# EasyEDA Pro project MN42_v2.eprj, board MOAR_Board
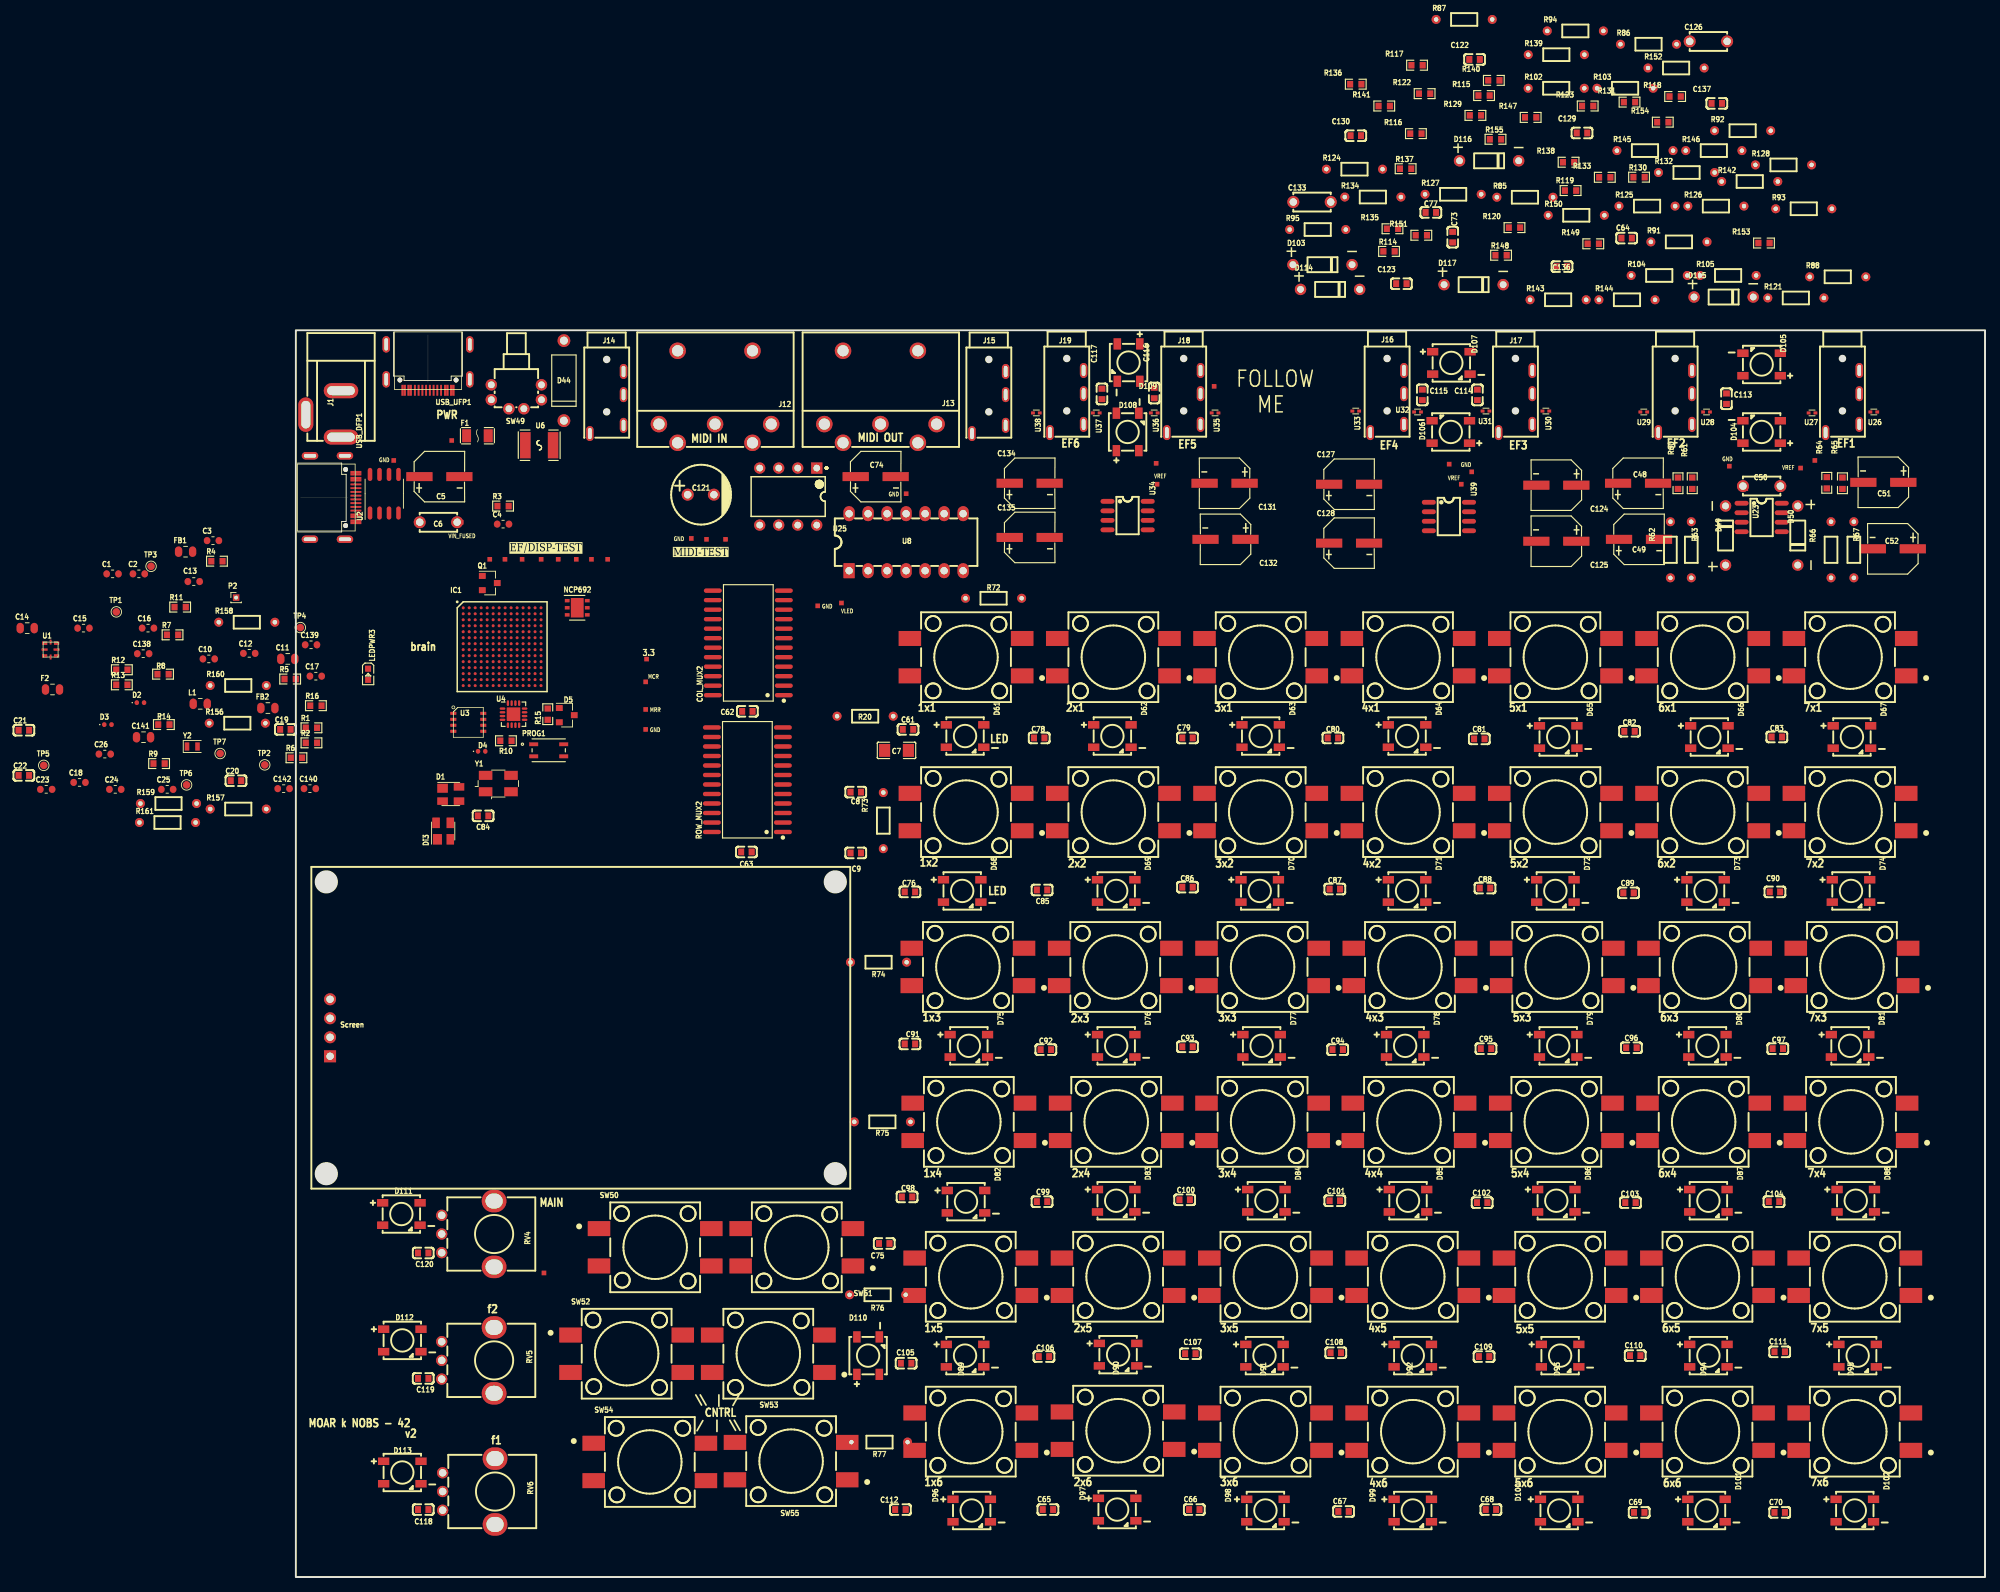
[diagram p4: board, top side]
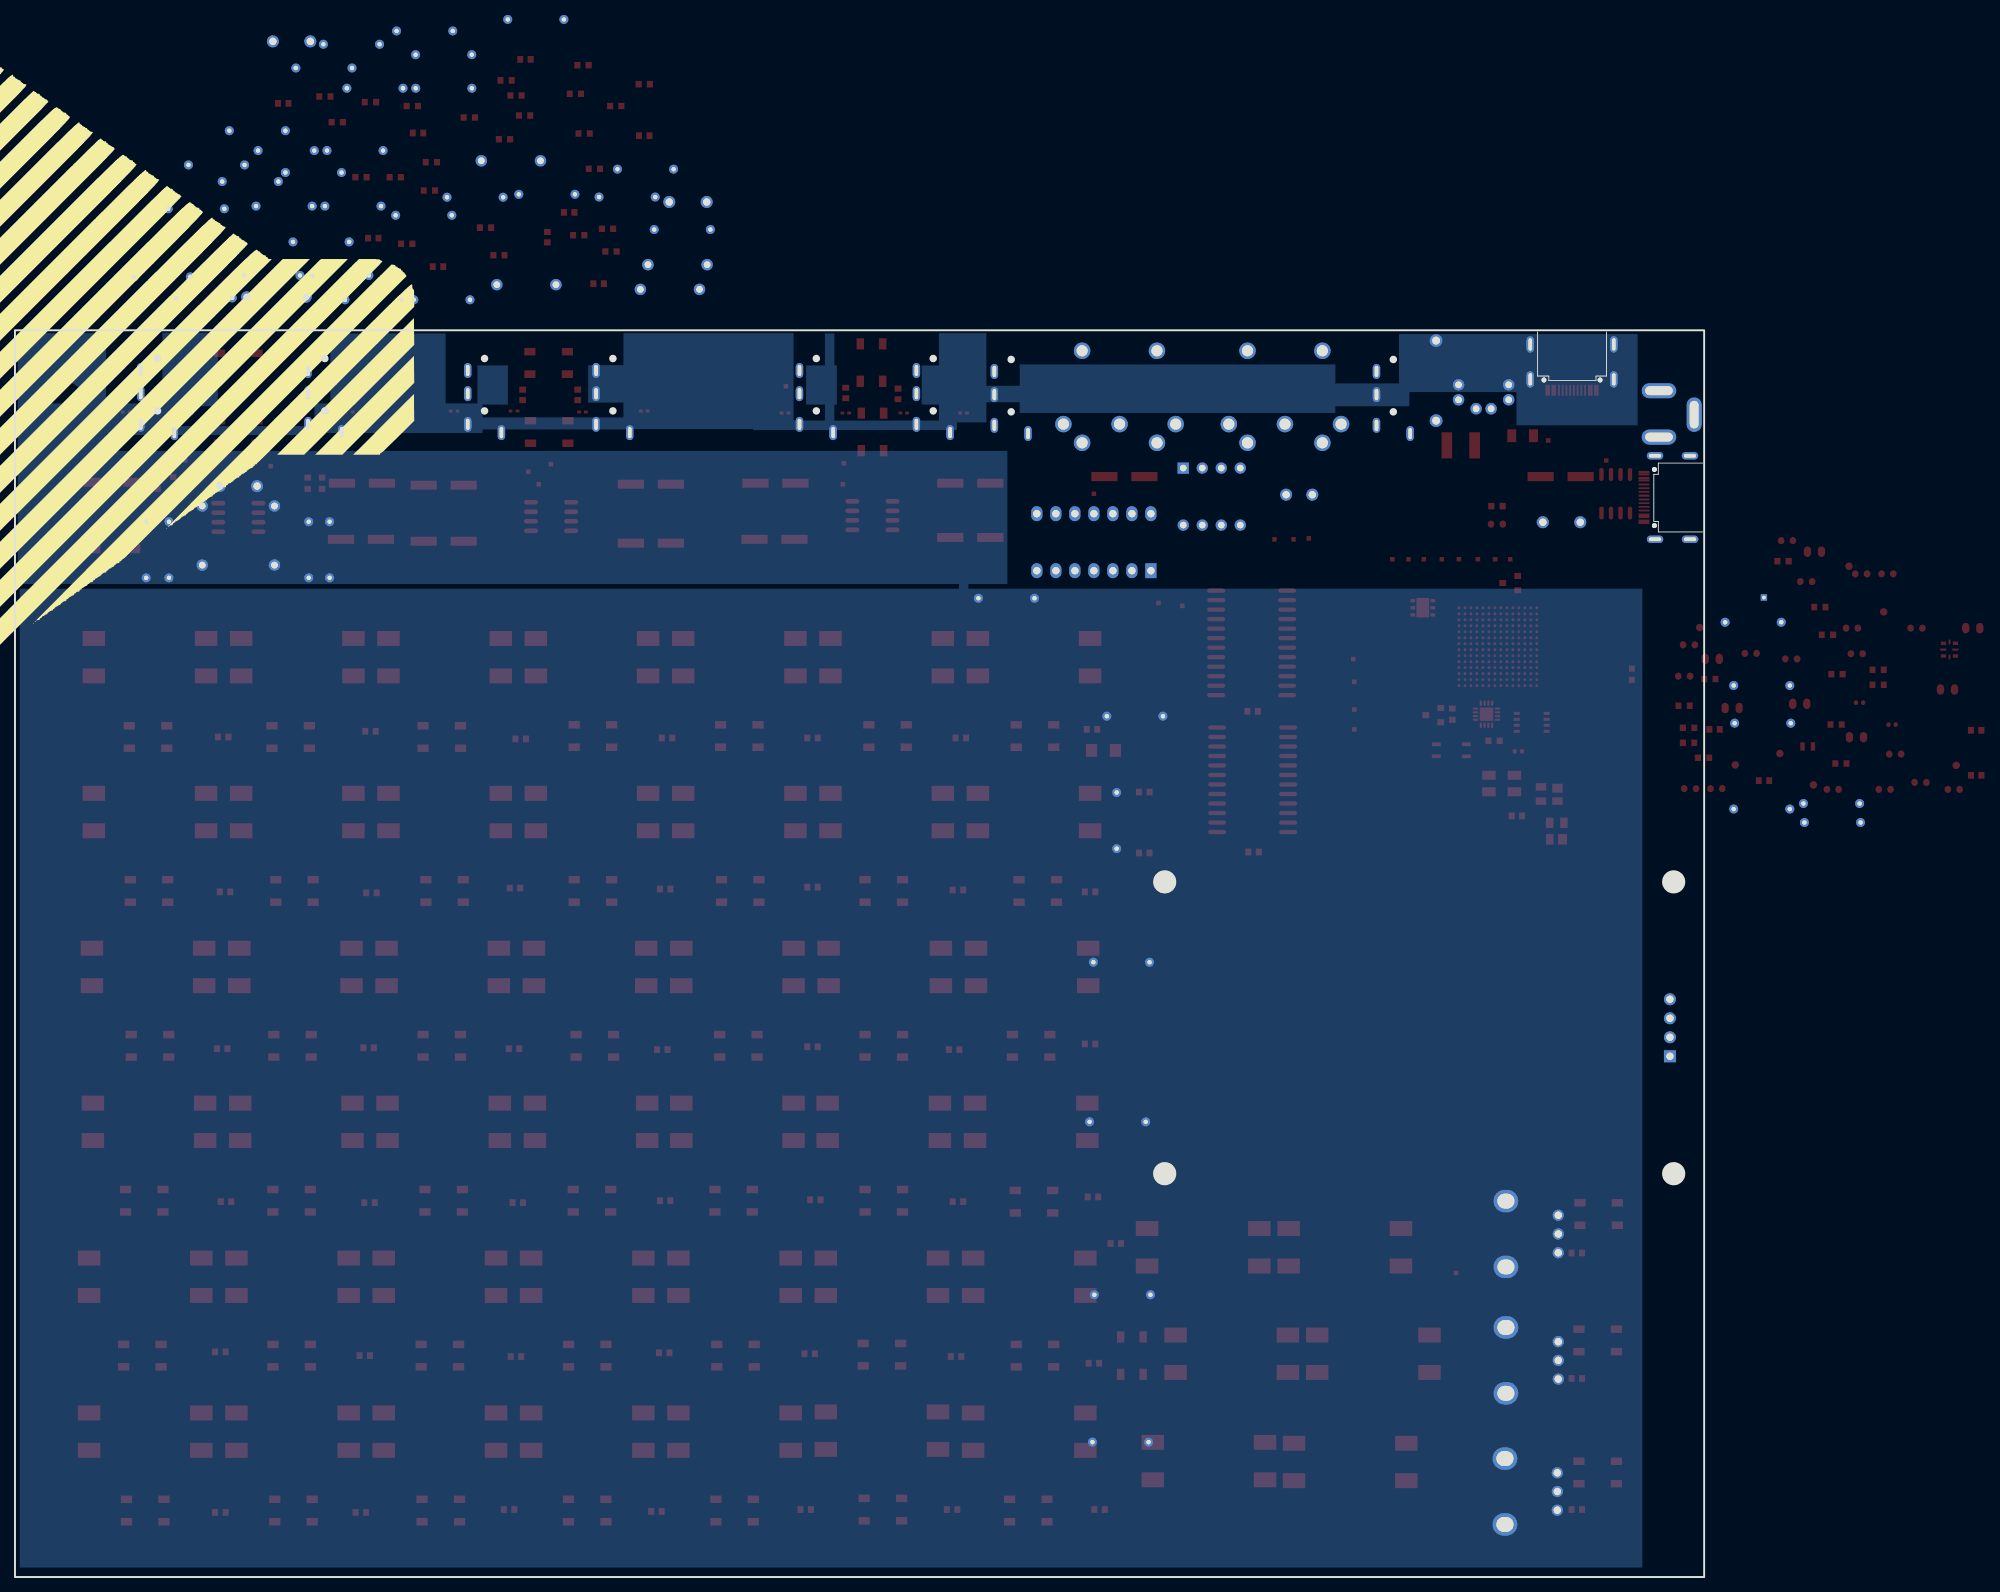
[diagram p5: board, bottom side, seen from below]

Outline 225.68 x 166.62 mm; copper layers: Top Layer, Inner1, Inner2, Bottom Layer. Coordinates in mm from the lower left corner of the outline.
Outline path: rectangle 0,166.62 225.68,0
Stack: Top Layer 0.035mm Outer layer thickness 1oz / Dielectric1 0.2104mm 7628 RC49% 8.6mil / Inner1 0.0152mm Inner layer thickness / Dielectric2 1.065mm 1.1mm H/HOZ Copper / Inner2 0.0152mm Inner layer thickness / Dielectric3 0.2104mm 7628 RC49% 8.6mil / Bottom Layer 0.035mm Outer layer thickness 1oz

## Design rules (mm)
template: User Custom Config
spacing safeClearance (default): track to track 0.152, other pairs 0.152 to 0.3
track width trackWidth (default): min 0.152, default 0.254, max 2.54
differential pair differentialPair (default): width min 0.127, default 0.254, max 2.54; gap min 0.152, default 0.152
via viaSize (default): diameter min 0.61, default 0.711, max 10; hole min 0.3, default 0.305, max 5.999

## Placement (name value [footprint] x y rotation side)
C1  0.22uf  [Capacitor_SMD:C_0603_1608Metric]  -24.49 134.07 0 top
C2  0.22uf  [Capacitor_SMD:C_0603_1608Metric]  -20.98 134.07 0 top
C3  2.2uf  [Capacitor_SMD:C_0603_1608Metric]  -11.07 138.51 0 top
C4  0.22uf  [Capacitor_SMD:C_0603_1608Metric]  27.69 140.72 0 top
C5  220uF  [CAP-SMD_BD6.3-L6.6-W6.6-FD]  19.18 147.07 0 top
C6  100nF  [CAP-TH_L5.0-W2.5-P5.00-D1.0]  19.05 140.97 0 top
C7  100uF  [C1206]  80.25 110.48 0 top
C8  1uF  [C0603]  74.8 104.9 180 top
C9  100nF  [C0603]  74.8 96.77 180 top
C10  0.22uf  [Capacitor_SMD:C_0603_1608Metric]  -11.63 122.7 0 top
C11  10uf  [Capacitor_SMD:C_0805_2012Metric]  -1.08 122.7 0 top
C12  4.7uf  [Capacitor_SMD:C_0603_1608Metric]  -6.22 123.44 0 top
C13  0.22uf  [Capacitor_SMD:C_0603_1608Metric]  -13.64 133.04 0 top
C14  10uf  [Capacitor_SMD:C_0805_2012Metric]  -35.89 126.82 0 top
C15  4.7uf  [Capacitor_SMD:C_0603_1608Metric]  -28.37 126.82 0 top
C16  10nf  [Capacitor_SMD:C_0603_1608Metric]  -19.75 126.82 0 top
C17  0.22uf  [Capacitor_SMD:C_0603_1608Metric]  2.67 120.4 0 top
C18  0.22uf  [Capacitor_SMD:C_0603_1608Metric]  -28.9 106.2 0 top
C19  10pf  [C0603]  -1.4 113.28 0 top
C20  10pf  [C0603]  -8 106.43 0 top
C21  9pf  [C0603]  -36.34 113.17 0 top
C22  9pf  [C0603]  -36.34 107.13 0 top
C23  0.22uf  [Capacitor_SMD:C_0603_1608Metric]  -33.35 105.27 0 top
C24  4.7uf  [Capacitor_SMD:C_0603_1608Metric]  -24.12 105.27 0 top
C25  0.22uf  [Capacitor_SMD:C_0603_1608Metric]  -17.18 105.27 0 top
C26  4.7uf  [Capacitor_SMD:C_0603_1608Metric]  -25.53 109.98 0 top
C48  1uF  [CAP-SMD_BD6.3-L6.6-W6.6-FD]  179.32 146.18 0 top
C49  1uF  [CAP-SMD_BD6.3-L6.6-W6.6-FD]  179.45 138.68 0 top
C50  100nF  [CAP-TH_L5.0-W2.5-P5.00-D1.0]  195.83 145.8 180 top
C51  1uF  [CAP-SMD_BD6.3-L6.6-W6.6-FD]  212.09 146.3 180 top
C52  1uF  [CAP-SMD_BD6.3-L6.6-W6.6-FD]  213.36 137.41 180 top
C61  100nF  [C0603]  81.79 113.28 0 top
C62  100nF  [C0603]  60.33 115.7 0 top
C63  100nF  [C0603]  60.2 96.9 0 top
C64  100nF  [C0603]  177.8 178.94 0 top
C65  100nF  [C0603]  100.48 9.02 0 top
C66  100nF  [C0603]  120.04 9.02 0 top
C67  100nF  [C0603]  139.98 8.76 0 top
C68  100nF  [C0603]  159.66 9.02 0 top
C69  100nF  [C0603]  179.47 8.64 0 top
C70  100nF  [C0603]  198.25 8.64 0 top
C73  1uF  [C0603]  154.56 179.07 270 top
C74  10uF  [CAP-SMD_BD6.3-L6.6-W6.6-FD]  77.47 147.07 0 top
C75  100nF  [C0603]  78.61 44.58 0 top
C76  100nF  [C0603]  82.04 91.57 0 top
C77  4.7nF  [C0603]  151.64 182.37 0 top
C78  100nF  [C0603]  99.31 112.14 0 top
C79  100nF  [C0603]  119.13 112.14 0 top
C80  100nF  [C0603]  138.56 112.14 180 top
C81  100nF  [C0603]  158.12 112.01 180 top
C82  100nF  [C0603]  178.18 113.03 180 top
C83  100nF  [C0603]  197.87 112.27 180 top
C84  100nF  [C0603]  25.02 101.73 0 top
C85  100nF  [C0603]  99.7 91.82 0 top
C86  100nF  [C0603]  119.13 92.2 0 top
C87  100nF  [C0603]  138.81 91.95 0 top
C88  100nF  [C0603]  158.88 92.08 0 top
C89  100nF  [C0603]  178.05 91.44 0 top
C90  100nF  [C0603]  197.61 91.57 0 top
C91  100nF  [C0603]  82.04 71.25 0 top
C92  100nF  [C0603]  100.2 70.48 0 top
C93  100nF  [C0603]  119.13 70.87 0 top
C94  100nF  [C0603]  139.19 70.48 0 top
C95  100nF  [C0603]  159 70.61 0 top
C96  100nF  [C0603]  178.44 70.74 0 top
C97  100nF  [C0603]  197.99 70.61 0 top
C98  100nF  [C0603]  81.66 50.8 0 top
C99  100nF  [C0603]  99.7 50.16 0 top
C100  100nF  [C0603]  118.74 50.42 0 top
C101  100nF  [C0603]  138.81 50.29 0 top
C102  100nF  [C0603]  158.5 50.04 0 top
C103  100nF  [C0603]  178.31 50.04 0 top
C104  100nF  [C0603]  197.49 50.16 0 top
C105  100nF  [C0603]  81.53 28.57 0 top
C106  100nF  [C0603]  99.95 29.46 0 top
C107  100nF  [C0603]  119.51 29.84 0 top
C108  100nF  [C0603]  138.94 29.97 0 top
C109  100nF  [C0603]  158.75 29.46 0 top
C110  100nF  [C0603]  178.94 29.59 0 top
C111  100nF  [C0603]  198.25 30.1 0 top
C112  100nF  [C0603]  80.77 9.02 0 top
C113  100nF  [C0603]  191.13 157.48 270 top
C114  100nF  [C0603]  157.86 157.99 270 top
C115  100nF  [C0603]  150.5 157.99 270 top
C116  100nF  [C0603]  114.68 158.24 270 top
C117  100nF  [C0603]  107.7 158.12 270 top
C118  100nF  [C0603]  17.02 9.02 0 top
C119  100nF  [C0603]  17.02 26.54 0 top
C120  100nF  [C0603]  17.02 43.31 0 top
C121  1000uF  [CAP-TH_BD8.0-P3.50-D0.6-FD]  54.1 144.65 0 top
C122  2.2uF  [C0603]  157.48 202.82 0 top
C123  2.2uF  [C0603]  147.7 172.85 0 top
C124  1uF  [CAP-SMD_BD6.3-L6.6-W6.6-FD]  168.4 145.92 180 top
C125  1uF  [CAP-SMD_BD6.3-L6.6-W6.6-FD]  168.4 138.43 180 top
C126  100nF  [CAP-TH_L5.0-W2.5-P5.00-D1.0]  188.72 205.23 0 top
C127  1uF  [CAP-SMD_BD6.3-L6.6-W6.6-FD]  140.72 146.05 0 top
C128  1uF  [CAP-SMD_BD6.3-L6.6-W6.6-FD]  140.72 138.18 0 top
C129  2.2uF  [C0603]  171.83 193 0 top
C130  2.2uF  [C0603]  141.61 192.63 0 top
C131  1uF  [CAP-SMD_BD6.3-L6.6-W6.6-FD]  124.08 146.18 180 top
C132  1uF  [CAP-SMD_BD6.3-L6.6-W6.6-FD]  124.21 138.68 180 top
C133  100nF  [CAP-TH_L5.0-W2.5-P5.00-D1.0]  135.76 183.77 0 top
C134  1uF  [CAP-SMD_BD6.3-L6.6-W6.6-FD]  98.04 146.18 0 top
C135  1uF  [CAP-SMD_BD6.3-L6.6-W6.6-FD]  98.04 138.94 0 top
C136  2.2uF  [C0603]  169.16 175.13 0 top
C137  2.2uF  [C0603]  189.84 196.94 0 top
C138  2.2uf  [Capacitor_SMD:C_0603_1608Metric]  -20.39 123.4 0 top
C139  0.22uf  [Capacitor_SMD:C_0603_1608Metric]  2.03 124.59 0 top
C140  4.7uf  [Capacitor_SMD:C_0603_1608Metric]  1.88 105.37 0 top
C141  10uf  [Capacitor_SMD:C_0805_2012Metric]  -20.35 112.24 0 top
C142  10nf  [Capacitor_SMD:C_0603_1608Metric]  -1.63 105.37 0 top
COL_MUX2  CD74HC4067M96  [SOIC-24_L15.4-W7.5-P1.27-LS10.3-BL]  60.45 124.84 90 top
D1  SP0503BAHT  [Package_TO_SOT_SMD:SOT-143]  20.7 104.65 0 top
D2  LED  [LED_SMD:LED_0402_1005Metric]  -20.77 116.86 0 top
D3  LED  [LED_SMD:LED_0402_1005Metric]  -25.11 113.93 0 top
D4  LED  [LED_SMD:LED_0402_1005Metric]  24.82 110.35 0 top
D5  BAT54C  [Package_TO_SOT_SMD:SOT-23]  36.19 115.19 0 top
D44  SA6.0A  [DO-15_BD3.1-L6.7-P10.70-D0.8-RD]  35.81 159.89 90 top
D49  1N4148PF  [DO-35_BD1.9-L3.9-P7.90-D0.5-FD]  191.01 139.19 90 top
D50  1N4148PF  [DO-35_BD1.9-L3.9-P7.90-D0.5-FD]  200.66 139.19 270 top
D61  XL-5050RGBC-WS2812B  [LED-SMD_4P-L5.0-W5.0-BL_XL-5050RGBC]  89.41 112.39 270 top
D62  XL-5050RGBC-WS2812B  [LED-SMD_4P-L5.0-W5.0-BL_XL-5050RGBC]  109.09 112.39 270 top
D63  XL-5050RGBC-WS2812B  [LED-SMD_4P-L5.0-W5.0-BL_XL-5050RGBC]  128.9 112.39 270 top
D64  XL-5050RGBC-WS2812B  [LED-SMD_4P-L5.0-W5.0-BL_XL-5050RGBC]  148.46 112.39 270 top
D65  XL-5050RGBC-WS2812B  [LED-SMD_4P-L5.0-W5.0-BL_XL-5050RGBC]  168.66 112.27 270 top
D66  XL-5050RGBC-WS2812B  [LED-SMD_4P-L5.0-W5.0-BL_XL-5050RGBC]  188.85 112.27 270 top
D67  XL-5050RGBC-WS2812B  [LED-SMD_4P-L5.0-W5.0-BL_XL-5050RGBC]  207.9 112.27 270 top
D68  XL-5050RGBC-WS2812B  [LED-SMD_4P-L5.0-W5.0-BL_XL-5050RGBC]  89.03 91.69 270 top
D69  XL-5050RGBC-WS2812B  [LED-SMD_4P-L5.0-W5.0-BL_XL-5050RGBC]  109.6 91.69 270 top
D70  XL-5050RGBC-WS2812B  [LED-SMD_4P-L5.0-W5.0-BL_XL-5050RGBC]  128.78 91.69 270 top
D71  XL-5050RGBC-WS2812B  [LED-SMD_4P-L5.0-W5.0-BL_XL-5050RGBC]  148.46 91.69 270 top
D72  XL-5050RGBC-WS2812B  [LED-SMD_4P-L5.0-W5.0-BL_XL-5050RGBC]  168.27 91.69 270 top
D73  XL-5050RGBC-WS2812B  [LED-SMD_4P-L5.0-W5.0-BL_XL-5050RGBC]  188.34 91.69 270 top
D74  XL-5050RGBC-WS2812B  [LED-SMD_4P-L5.0-W5.0-BL_XL-5050RGBC]  207.77 91.69 270 top
D75  XL-5050RGBC-WS2812B  [LED-SMD_4P-L5.0-W5.0-BL_XL-5050RGBC]  89.92 70.99 270 top
D76  XL-5050RGBC-WS2812B  [LED-SMD_4P-L5.0-W5.0-BL_XL-5050RGBC]  109.6 70.99 270 top
D77  XL-5050RGBC-WS2812B  [LED-SMD_4P-L5.0-W5.0-BL_XL-5050RGBC]  129.03 70.99 270 top
D78  XL-5050RGBC-WS2812B  [LED-SMD_4P-L5.0-W5.0-BL_XL-5050RGBC]  148.21 70.99 270 top
D79  XL-5050RGBC-WS2812B  [LED-SMD_4P-L5.0-W5.0-BL_XL-5050RGBC]  168.66 70.99 270 top
D80  XL-5050RGBC-WS2812B  [LED-SMD_4P-L5.0-W5.0-BL_XL-5050RGBC]  188.59 70.99 270 top
D81  XL-5050RGBC-WS2812B  [LED-SMD_4P-L5.0-W5.0-BL_XL-5050RGBC]  207.64 70.99 270 top
D82  XL-5050RGBC-WS2812B  [LED-SMD_4P-L5.0-W5.0-BL_XL-5050RGBC]  89.53 50.16 270 top
D83  XL-5050RGBC-WS2812B  [LED-SMD_4P-L5.0-W5.0-BL_XL-5050RGBC]  109.6 50.29 270 top
D84  XL-5050RGBC-WS2812B  [LED-SMD_4P-L5.0-W5.0-BL_XL-5050RGBC]  129.67 50.29 270 top
D85  XL-5050RGBC-WS2812B  [LED-SMD_4P-L5.0-W5.0-BL_XL-5050RGBC]  148.59 50.29 270 top
D86  XL-5050RGBC-WS2812B  [LED-SMD_4P-L5.0-W5.0-BL_XL-5050RGBC]  168.4 50.29 270 top
D87  XL-5050RGBC-WS2812B  [LED-SMD_4P-L5.0-W5.0-BL_XL-5050RGBC]  188.72 50.29 270 top
D88  XL-5050RGBC-WS2812B  [LED-SMD_4P-L5.0-W5.0-BL_XL-5050RGBC]  208.41 50.29 270 top
D89  XL-5050RGBC-WS2812B  [LED-SMD_4P-L5.0-W5.0-BL_XL-5050RGBC]  89.41 29.59 270 top
D90  XL-5050RGBC-WS2812B  [LED-SMD_4P-L5.0-W5.0-BL_XL-5050RGBC]  109.86 29.72 270 top
D91  XL-5050RGBC-WS2812B  [LED-SMD_4P-L5.0-W5.0-BL_XL-5050RGBC]  129.41 29.59 270 top
D92  XL-5050RGBC-WS2812B  [LED-SMD_4P-L5.0-W5.0-BL_XL-5050RGBC]  149.23 29.59 270 top
D93  XL-5050RGBC-WS2812B  [LED-SMD_4P-L5.0-W5.0-BL_XL-5050RGBC]  168.91 29.59 270 top
D94  XL-5050RGBC-WS2812B  [LED-SMD_4P-L5.0-W5.0-BL_XL-5050RGBC]  188.72 29.59 270 top
D95  XL-5050RGBC-WS2812B  [LED-SMD_4P-L5.0-W5.0-BL_XL-5050RGBC]  208.66 29.59 270 top
D96  XL-5050RGBC-WS2812B  [LED-SMD_4P-L5.0-W5.0-BL_XL-5050RGBC]  90.3 8.89 270 top
D97  XL-5050RGBC-WS2812B  [LED-SMD_4P-L5.0-W5.0-BL_XL-5050RGBC]  109.73 9.02 270 top
D98  XL-5050RGBC-WS2812B  [LED-SMD_4P-L5.0-W5.0-BL_XL-5050RGBC]  129.54 8.89 270 top
D99  XL-5050RGBC-WS2812B  [LED-SMD_4P-L5.0-W5.0-BL_XL-5050RGBC]  149.23 8.89 270 top
D100  XL-5050RGBC-WS2812B  [LED-SMD_4P-L5.0-W5.0-BL_XL-5050RGBC]  168.78 8.89 270 top
D101  XL-5050RGBC-WS2812B  [LED-SMD_4P-L5.0-W5.0-BL_XL-5050RGBC]  188.47 8.89 270 top
D102  XL-5050RGBC-WS2812B  [LED-SMD_4P-L5.0-W5.0-BL_XL-5050RGBC]  208.28 8.89 270 top
D103  1N4148PF  [DO-35_BD1.9-L3.9-P7.90-D0.5-FD]  137.16 175.39 0 top
D104  XL-5050RGBC-WS2812B  [LED-SMD_4P-L5.0-W5.0-BL_XL-5050RGBC]  195.83 153.03 90 top
D105  XL-5050RGBC-WS2812B  [LED-SMD_4P-L5.0-W5.0-BL_XL-5050RGBC]  195.83 162.05 90 top
D106  XL-5050RGBC-WS2812B  [LED-SMD_4P-L5.0-W5.0-BL_XL-5050RGBC]  154.31 153.03 90 top
D107  XL-5050RGBC-WS2812B  [LED-SMD_4P-L5.0-W5.0-BL_XL-5050RGBC]  154.38 162.26 270 top
D108  XL-5050RGBC-WS2812B  [LED-SMD_4P-L5.0-W5.0-BL_XL-5050RGBC]  111.12 153.03 0 top
D109  XL-5050RGBC-WS2812B  [LED-SMD_4P-L5.0-W5.0-BL_XL-5050RGBC]  111.25 162.31 180 top
D110  XL-5050RGBC-WS2812B  [LED-SMD_4P-L5.0-W5.0-BL_XL-5050RGBC]  76.45 29.59 0 top
D111  XL-5050RGBC-WS2812B  [LED-SMD_4P-L5.0-W5.0-BL_XL-5050RGBC]  14.1 48.51 270 top
D112  XL-5050RGBC-WS2812B  [LED-SMD_4P-L5.0-W5.0-BL_XL-5050RGBC]  14.22 31.62 270 top
D113  XL-5050RGBC-WS2812B  [LED-SMD_4P-L5.0-W5.0-BL_XL-5050RGBC]  14.22 13.97 270 top
D114  1N4148PF  [DO-35_BD1.9-L3.9-P7.90-D0.5-FD]  138.18 172.09 0 top
D115  1N4148PF  [DO-35_BD1.9-L3.9-P7.90-D0.5-FD]  190.75 171.07 0 top
D116  1N4148PF  [DO-35_BD1.9-L3.9-P7.90-D0.5-FD]  159.42 189.28 0 top
D117  1N4148PF  [DO-35_BD1.9-L3.9-P7.90-D0.5-FD]  157.35 172.72 0 top
Di3  SP0503BAHT  [Package_TO_SOT_SMD:SOT-143]  19.68 99.69 90 top
F1  nSMD050-33V  [F1206]  24.26 152.53 0 top
F2  Fuse  [Resistor_SMD:R_0805_2012Metric]  -32.51 118.62 0 top
FB1  Ferrite_Bead  [Resistor_SMD:R_0805_2012Metric]  -14.73 137.03 0 top
FB2  Ferrite_Bead  [Resistor_SMD:R_0805_2012Metric]  -3.74 116.14 0 top
IC1  MIMXRT1062DVJ6B  [MIMXRT1062DVJ6B:BGA196C80P14X14_1200X1200X152]  27.56 124.33 0 top
J1  DC005  [DC-IN-TH_DC005]  3.68 155.45 270 top
J8  HC-PJ-320A  [AUDIO-SMD_HC-PJ-320A]  184.28 157.1 270 top
J9  HC-PJ-320A  [AUDIO-SMD_HC-PJ-320A]  206.63 157.1 270 top
J12  DIN-504B-M10  [CONN-TH_DIN-504B-M10]  56.01 157.73 180 top
J13  DIN-504B-M10  [CONN-TH_DIN-504B-M10]  78.11 157.73 180 top
J14  HC-PJ-320A  [AUDIO-SMD_HC-PJ-320A]  41.53 156.97 270 top
J15  HC-PJ-320A  [AUDIO-SMD_HC-PJ-320A]  92.58 156.97 270 top
J16  HC-PJ-320A  [AUDIO-SMD_HC-PJ-320A]  145.8 157.1 270 top
J17  HC-PJ-320A  [AUDIO-SMD_HC-PJ-320A]  162.94 157.1 270 top
J18  HC-PJ-320A  [AUDIO-SMD_HC-PJ-320A]  118.62 157.1 270 top
J19  HC-PJ-320A  [AUDIO-SMD_HC-PJ-320A]  103 157.1 270 top
L1  4.7uH  [Capacitor_SMD:C_0805_2012Metric]  -12.77 116.7 0 top
LEDPWR3  XL-1608UBC-04  [LED0603-RD_BLUE]  9.65 120.65 270 top
NCP692  OnSemi NCP692, fixed version  [Package_DFN_QFN:DFN-6-1EP_3x3mm_P0.95mm_EP1.7x2.6mm]  37.59 129.54 0 top
NOREF  -  [Pad_e234]  46.74 119.63 0 top
NOREF#2  -  [Pad_e6017]  72.9 130.18 0 top
NOREF#3  -  [Pad_e955723]  201.04 148.21 0 top
NOREF#4  -  [Pad_e373]  202.95 149.22 0 top
NOREF#5  -  [Pad_e954935]  114.93 148.84 0 top
NOREF#6  -  [Pad_e146]  20.83 151.89 0 top
NOREF#7  -  [Pad_e730]  191.52 148.46 180 top
NOREF#8  -  [Pad_e954561]  46.74 113.28 0 top
NOREF#9  -  [Pad_e954937]  69.72 129.79 0 top
NOREF#10  -  [Pad_e6021]  37.47 136.02 0 top
NOREF#11  -  [Pad_e6036]  32.77 136.02 0 top
NOREF#12  -  [Pad_e724]  81.53 144.78 0 top
NOREF#13  -  [Pad_e6022]  39.5 136.02 0 top
NOREF#14  -  [Pad_e6020]  35.05 136.02 0 top
NOREF#15  -  [Pad_e371]  122.68 159.13 0 top
NOREF#16  -  [Pad_e6023]  41.66 136.02 0 top
NOREF#17  -  [Pad_e6029]  25.91 136.02 0 top
NOREF#18  -  [Pad_e372]  157.1 147.7 0 top
NOREF#19  -  [Pad_e370]  33.15 40.64 0 top
NOREF#20  -  [Pad_e6015]  57.4 138.68 0 top
NOREF#21  -  [Pad_e213]  22.1 140.97 0 top
NOREF#22  -  [Pad_e6019]  27.94 136.02 0 top
NOREF#23  -  [Pad_e954575]  13.08 149.22 0 top
NOREF#24  -  [Pad_e223]  155.7 146.05 0 top
NOREF#25  -  [Pad_e726]  154.09 148.73 180 top
NOREF#26  -  [Pad_e236]  46.74 115.95 0 top
NOREF#27  -  [Pad_e6013]  54.86 138.68 0 top
NOREF#28  -  [Pad_e954570]  52.83 138.81 0 top
NOREF#29  -  [Pad_e6035]  30.23 136.02 0 top
NOREF#30  -  [Pad_e229]  193.72 145.45 0 top
NOREF#31  -  [Pad_e222]  115.06 146.05 0 top
NOREF#32  -  [Pad_e215]  46.86 122.68 0 top
P2  D26  [Connector_PinHeader_1.00mm:PinHeader_1x01_P1.00mm_Vertical]  -7.98 130.9 0 top
PROG1  SW_Push  [ToyTronics:KMR241GLFS]  33.78 110.49 0 top
Q1  Q_PMOS_GDS_DMP3125L  [Package_TO_SOT_SMD:SOT-23]  25.91 132.84 0 top
R1  5.1k  [R0603]  2.08 113.49 0 top
R2  5.1k  [R0603]  2.08 111.48 0 top
R3  100k  [R0603]  27.69 143.13 0 top
R4  100k  [R0603]  -10.54 135.76 0 top
R5  1M  [R0603]  -0.76 120.02 0 top
R6  16k  [R0603]  0.08 109.49 0 top
R7  16k  [R0603]  -16.47 125.92 0 top
R8  1k  [R0603]  -17.74 120.67 0 top
R9  1M  [R0603]  -18.27 108.72 0 top
R10  1k  [R0603]  28.07 111.76 0 top
R11  100k  [R0603]  -15.46 129.63 0 top
R12  56k  [R0603]  -23.25 121.25 0 top
R13  56k  [R0603]  -23.25 119.24 0 top
R14  1k  [R0603]  -17.64 113.93 0 top
R15  2.2M  [R0603]  33.66 115.32 90 top
R16  100k  [R0603]  2.68 116.45 0 top
R20  33Ω  [RES-TH_BD1.7-L3.5-P7.50-D0.5]  76.06 115.05 0 top
R60  100kΩ  [R0603]  184.66 146.18 90 top
R61  100kΩ  [R0603]  186.56 146.18 90 top
R62  22kΩ  [RES-TH_BD1.7-L3.5-P7.50-D0.5]  183.64 137.29 90 top
R63  10kΩ  [RES-TH_BD1.7-L3.5-P7.50-D0.5]  186.44 137.29 90 top
R64  100kΩ  [R0603]  204.53 146.24 90 top
R65  100kΩ  [R0603]  206.63 146.18 90 top
R66  22kΩ  [RES-TH_BD1.7-L3.5-P7.50-D0.5]  205.11 137.29 90 top
R67  10kΩ  [RES-TH_BD1.7-L3.5-P7.50-D0.5]  208.15 137.29 90 top
R72  10kΩ  [RES-TH_BD1.7-L3.5-P7.50-D0.5]  93.22 130.81 0 top
R73  10kΩ  [RES-TH_BD1.7-L3.5-P7.50-D0.5]  78.49 101.09 270 top
R74  10kΩ  [RES-TH_BD1.7-L3.5-P7.50-D0.5]  77.85 82.17 0 top
R75  10kΩ  [RES-TH_BD1.7-L3.5-P7.50-D0.5]  78.36 60.83 0 top
R76  10kΩ  [RES-TH_BD1.7-L3.5-P7.50-D0.5]  77.72 37.72 0 top
R77  10kΩ  [RES-TH_BD1.7-L3.5-P7.50-D0.5]  77.98 18.03 0 top
R85  220Ω  [RES-TH_BD1.7-L3.5-P7.50-D0.5]  164.21 184.4 0 top
R86  220Ω  [RES-TH_BD1.7-L3.5-P7.50-D0.5]  180.72 204.85 0 top
R87  220Ω  [RES-TH_BD1.7-L3.5-P7.50-D0.5]  156.09 208.16 0 top
R88  4.7kΩ  [RES-TH_BD1.7-L3.5-P7.50-D0.5]  206 173.77 0 top
R91  4.7kΩ  [RES-TH_BD1.7-L3.5-P7.50-D0.5]  184.79 178.44 0 top
R92  4.7kΩ  [RES-TH_BD1.7-L3.5-P7.50-D0.5]  193.29 193.29 0 top
R93  220Ω  [RES-TH_BD1.7-L3.5-P7.50-D0.5]  201.46 182.86 0 top
R94  220Ω  [RES-TH_BD1.7-L3.5-P7.50-D0.5]  170.94 206.63 0 top
R95  220Ω  [RES-TH_BD1.7-L3.5-P7.50-D0.5]  136.52 180.09 0 top
R102  1kΩ  [RES-TH_BD1.7-L3.5-P7.50-D0.5]  168.39 198.97 0 top
R103  1kΩ  [RES-TH_BD1.7-L3.5-P7.50-D0.5]  177.59 198.97 0 top
R104  1kΩ  [RES-TH_BD1.7-L3.5-P7.50-D0.5]  182.15 173.95 0 top
R105  1kΩ  [RES-TH_BD1.7-L3.5-P7.50-D0.5]  191.35 173.95 0 top
R114  4.7KΩ  [R0603]  146.05 177.16 0 top
R115  100kΩ  [R0603]  158.75 197.99 0 top
R116  68Ω  [R0603]  149.64 192.9 0 top
R117  68Ω  [R0603]  149.79 202.05 0 top
R118  100kΩ  [R0603]  184.28 197.87 0 top
R119  4.7K  [R0603]  170.31 185.29 0 top
R120  100kΩ  [R0603]  162.81 180.34 0 top
R121  22kΩ  [RES-TH_BD1.7-L3.5-P7.50-D0.5]  200.41 170.94 0 top
R122  100kΩ  [R0603]  150.81 198.25 0 top
R123  100kΩ  [R0603]  172.59 196.6 0 top
R124  22kΩ  [RES-TH_BD1.7-L3.5-P7.50-D0.5]  141.43 188.15 0 top
R125  1kΩ  [RES-TH_BD1.7-L3.5-P7.50-D0.5]  180.52 183.22 0 top
R126  1kΩ  [RES-TH_BD1.7-L3.5-P7.50-D0.5]  189.73 183.22 0 top
R127  1kΩ  [RES-TH_BD1.7-L3.5-P7.50-D0.5]  154.62 184.79 0 top
R128  1kΩ  [RES-TH_BD1.7-L3.5-P7.50-D0.5]  198.75 188.72 0 top
R129  100kΩ  [R0603]  157.59 195.34 0 top
R130  4.7KΩ  [R0603]  179.45 187.09 0 top
R131  100kΩ  [R0603]  178.18 197.12 0 top
R132  10kΩ  [RES-TH_BD1.7-L3.5-P7.50-D0.5]  185.8 187.71 0 top
R133  68Ω  [R0603]  174.88 187.07 0 top
R134  10kΩ  [RES-TH_BD1.7-L3.5-P7.50-D0.5]  143.89 184.43 0 top
R135  68Ω  [R0603]  146.51 180.19 0 top
R136  100kΩ  [R0603]  141.61 199.52 0 top
R137  4.7K  [R0603]  148.27 188.21 0 top
R138  100kΩ  [R0603]  170.04 189.08 0 top
R139  22kΩ  [RES-TH_BD1.7-L3.5-P7.50-D0.5]  168.4 203.45 0 top
R140  100kΩ  [R0603]  160.05 200.02 0 top
R141  100kΩ  [R0603]  145.42 196.6 0 top
R142  22kΩ  [RES-TH_BD1.7-L3.5-P7.50-D0.5]  194.24 186.5 0 top
R143  1kΩ  [RES-TH_BD1.7-L3.5-P7.50-D0.5]  168.64 170.7 0 top
R144  1kΩ  [RES-TH_BD1.7-L3.5-P7.50-D0.5]  177.84 170.7 0 top
R145  1kΩ  [RES-TH_BD1.7-L3.5-P7.50-D0.5]  180.25 190.64 0 top
R146  1kΩ  [RES-TH_BD1.7-L3.5-P7.50-D0.5]  189.45 190.64 0 top
R147  100kΩ  [R0603]  164.97 195.07 0 top
R148  4.7KΩ  [R0603]  161.02 176.66 0 top
R149  100kΩ  [R0603]  173.34 178.18 0 top
R150  10kΩ  [RES-TH_BD1.7-L3.5-P7.50-D0.5]  171.07 181.99 0 top
R151  68Ω  [R0603]  150.37 179.32 0 top
R152  10kΩ  [RES-TH_BD1.7-L3.5-P7.50-D0.5]  184.4 201.68 0 top
R153  68Ω  [R0603]  196.15 178.28 0 top
R154  100kΩ  [R0603]  182.63 194.44 0 top
R155  4.7K  [R0603]  160.27 192.15 0 top
R156  220Ω  [RES-TH_BD1.7-L3.5-P7.50-D0.5]  -7.82 114.11 0 top
R157  220Ω  [RES-TH_BD1.7-L3.5-P7.50-D0.5]  -7.69 102.64 0 top
R158  220Ω  [RES-TH_BD1.7-L3.5-P7.50-D0.5]  -6.55 127.6 0 top
R159  220Ω  [RES-TH_BD1.7-L3.5-P7.50-D0.5]  -17.02 103.38 0 top
R160  220Ω  [RES-TH_BD1.7-L3.5-P7.50-D0.5]  -7.69 119.15 0 top
R161  220Ω  [RES-TH_BD1.7-L3.5-P7.50-D0.5]  -17.15 100.84 0 top
ROW_MUX2  CD74HC4067M96  [SOIC-24_L15.4-W7.5-P1.27-LS10.3-BL]  60.33 106.55 90 top
RV4  10kΩ  [RES-ADJ-TH_RK09K1130A5R]  22.99 45.85 270 top
RV5  10kΩ  [RES-ADJ-TH_RK09K1130A5R]  22.99 28.96 270 top
RV6  10kΩ  [RES-ADJ-TH_RK09K1130A5R]  23.11 11.43 270 top
Screen  HS242L03B2C01  [OLED-TH_4P-L72.0-W43.0-P2.54]  4.57 73.41 0 top
SW1  HX B3F-4055-Y  [SW-SMD_4P-L12.0-W12.0-P5.00-LS15.5]  89.53 122.94 180 top
SW2  HX B3F-4055-Y  [SW-SMD_4P-L12.0-W12.0-P5.00-LS15.5]  109.22 122.94 180 top
SW3  HX B3F-4055-Y  [SW-SMD_4P-L12.0-W12.0-P5.00-LS15.5]  128.9 122.94 180 top
SW4  HX B3F-4055-Y  [SW-SMD_4P-L12.0-W12.0-P5.00-LS15.5]  148.59 122.94 180 top
SW5  HX B3F-4055-Y  [SW-SMD_4P-L12.0-W12.0-P5.00-LS15.5]  168.27 122.94 180 top
SW6  HX B3F-4055-Y  [SW-SMD_4P-L12.0-W12.0-P5.00-LS15.5]  187.96 122.94 180 top
SW7  HX B3F-4055-Y  [SW-SMD_4P-L12.0-W12.0-P5.00-LS15.5]  207.64 122.94 180 top
SW8  HX B3F-4055-Y  [SW-SMD_4P-L12.0-W12.0-P5.00-LS15.5]  89.53 102.23 180 top
SW9  HX B3F-4055-Y  [SW-SMD_4P-L12.0-W12.0-P5.00-LS15.5]  109.22 102.23 180 top
SW10  HX B3F-4055-Y  [SW-SMD_4P-L12.0-W12.0-P5.00-LS15.5]  128.9 102.23 180 top
SW11  HX B3F-4055-Y  [SW-SMD_4P-L12.0-W12.0-P5.00-LS15.5]  148.59 102.23 180 top
SW12  HX B3F-4055-Y  [SW-SMD_4P-L12.0-W12.0-P5.00-LS15.5]  168.27 102.23 180 top
SW13  HX B3F-4055-Y  [SW-SMD_4P-L12.0-W12.0-P5.00-LS15.5]  187.96 102.23 180 top
SW14  HX B3F-4055-Y  [SW-SMD_4P-L12.0-W12.0-P5.00-LS15.5]  207.64 102.23 180 top
SW15  HX B3F-4055-Y  [SW-SMD_4P-L12.0-W12.0-P5.00-LS15.5]  89.79 81.53 180 top
SW16  HX B3F-4055-Y  [SW-SMD_4P-L12.0-W12.0-P5.00-LS15.5]  109.47 81.53 180 top
SW17  HX B3F-4055-Y  [SW-SMD_4P-L12.0-W12.0-P5.00-LS15.5]  129.16 81.53 180 top
SW18  HX B3F-4055-Y  [SW-SMD_4P-L12.0-W12.0-P5.00-LS15.5]  148.84 81.53 180 top
SW19  HX B3F-4055-Y  [SW-SMD_4P-L12.0-W12.0-P5.00-LS15.5]  168.53 81.53 180 top
SW20  HX B3F-4055-Y  [SW-SMD_4P-L12.0-W12.0-P5.00-LS15.5]  188.21 81.53 180 top
SW21  HX B3F-4055-Y  [SW-SMD_4P-L12.0-W12.0-P5.00-LS15.5]  207.9 81.53 180 top
SW22  HX B3F-4055-Y  [SW-SMD_4P-L12.0-W12.0-P5.00-LS15.5]  89.92 60.83 180 top
SW23  HX B3F-4055-Y  [SW-SMD_4P-L12.0-W12.0-P5.00-LS15.5]  109.6 60.83 180 top
SW24  HX B3F-4055-Y  [SW-SMD_4P-L12.0-W12.0-P5.00-LS15.5]  129.16 60.83 180 top
SW25  HX B3F-4055-Y  [SW-SMD_4P-L12.0-W12.0-P5.00-LS15.5]  148.72 60.83 180 top
SW26  HX B3F-4055-Y  [SW-SMD_4P-L12.0-W12.0-P5.00-LS15.5]  168.4 60.83 180 top
SW27  HX B3F-4055-Y  [SW-SMD_4P-L12.0-W12.0-P5.00-LS15.5]  188.09 60.83 180 top
SW28  HX B3F-4055-Y  [SW-SMD_4P-L12.0-W12.0-P5.00-LS15.5]  207.77 60.83 180 top
SW29  HX B3F-4055-Y  [SW-SMD_4P-L12.0-W12.0-P5.00-LS15.5]  90.17 40.13 180 top
SW30  HX B3F-4055-Y  [SW-SMD_4P-L12.0-W12.0-P5.00-LS15.5]  109.86 40.13 180 top
SW31  HX B3F-4055-Y  [SW-SMD_4P-L12.0-W12.0-P5.00-LS15.5]  129.54 40.13 180 top
SW32  HX B3F-4055-Y  [SW-SMD_4P-L12.0-W12.0-P5.00-LS15.5]  149.23 40.13 180 top
SW33  HX B3F-4055-Y  [SW-SMD_4P-L12.0-W12.0-P5.00-LS15.5]  168.91 40.13 180 top
SW34  HX B3F-4055-Y  [SW-SMD_4P-L12.0-W12.0-P5.00-LS15.5]  188.59 40.13 180 top
SW35  HX B3F-4055-Y  [SW-SMD_4P-L12.0-W12.0-P5.00-LS15.5]  208.28 40.13 180 top
SW36  HX B3F-4055-Y  [SW-SMD_4P-L12.0-W12.0-P5.00-LS15.5]  90.17 19.43 180 top
SW37  HX B3F-4055-Y  [SW-SMD_4P-L12.0-W12.0-P5.00-LS15.5]  109.86 19.56 180 top
SW38  HX B3F-4055-Y  [SW-SMD_4P-L12.0-W12.0-P5.00-LS15.5]  129.54 19.43 180 top
SW39  HX B3F-4055-Y  [SW-SMD_4P-L12.0-W12.0-P5.00-LS15.5]  149.23 19.43 180 top
SW40  HX B3F-4055-Y  [SW-SMD_4P-L12.0-W12.0-P5.00-LS15.5]  168.91 19.43 180 top
SW41  HX B3F-4055-Y  [SW-SMD_4P-L12.0-W12.0-P5.00-LS15.5]  188.59 19.43 180 top
SW42  HX B3F-4055-Y  [SW-SMD_4P-L12.0-W12.0-P5.00-LS15.5]  208.28 19.43 180 top
SW49  TK-6580A-1  [SW-TH_TK-6580A-1]  29.46 157.73 180 top
SW50  HX B3F-4055-Y  [SW-SMD_4P-L12.0-W12.0-P5.00-LS15.5]  48.01 44.07 0 top
SW51  HX B3F-4055-Y  [SW-SMD_4P-L12.0-W12.0-P5.00-LS15.5]  66.93 44.07 180 top
SW52  HX B3F-4055-Y  [SW-SMD_4P-L12.0-W12.0-P5.00-LS15.5]  44.2 29.84 0 top
SW53  HX B3F-4055-Y  [SW-SMD_4P-L12.0-W12.0-P5.00-LS15.5]  63.12 29.84 180 top
SW54  HX B3F-4055-Y  [SW-SMD_4P-L12.0-W12.0-P5.00-LS15.5]  47.29 15.38 0 top
SW55  HX B3F-4055-Y  [SW-SMD_4P-L12.0-W12.0-P5.00-LS15.5]  66.17 15.49 180 top
TP1  TestPoint  [TestPoint:TestPoint_Pad_D1.0mm]  -23.98 128.99 0 top
TP2  TestPoint  [TestPoint:TestPoint_Pad_D1.0mm]  -4.16 108.54 0 top
TP3  TestPoint  [TestPoint:TestPoint_Pad_D1.0mm]  -19.35 135.08 0 top
TP4  TestPoint  [TestPoint:TestPoint_Pad_D1.0mm]  0.6 126.89 0 top
TP5  TestPoint  [TestPoint:TestPoint_Pad_D1.0mm]  -33.68 108.48 0 top
TP6  TestPoint  [TestPoint:TestPoint_Pad_D1.0mm]  -14.6 105.86 0 top
TP7  TestPoint  [TestPoint:TestPoint_Pad_D1.0mm]  -10.12 110.06 0 top
U1  opto_APA102-2020  [USB-C-Power-tester:APA102-2020]  -32.77 123.95 0 top
U2  MAX1562  [Package_SO:SO-8_3.9x4.9mm_P1.27mm]  11.81 144.78 90 top
U3  W25Q64JVXGIM  [MIMXRT1062DVJ6B:XSON8_4x4mm]  23.24 114.43 0 top
U4  MKL02Z32VFG4  [Package_DFN_QFN:QFN-16-1EP_3x3mm_P0.5mm_EP1.8x1.8mm]  29.08 115.32 0 top
U6  1812L200/33GR  [F1812]  32.51 151.26 0 top
U8  SN74AHCT125N  [PDIP-14_L19.3-W6.4-P2.54-LS7.6-BL]  81.53 138.3 0 top
U23  MCP6002DRG  [SOP-8_L4.9-W3.9-P1.27-LS6.0-BL]  195.83 141.6 270 top
U25  6N138  [DIP-8_L9.8-W6.6-P2.54-LS7.6-BL]  65.79 144.4 180 top
U26  ESD9B5.0ST5G  [SOD-923_L0.8-W0.6-LS1.0-BI]  210.82 155.7 0 top
U27  ESD9B5.0ST5G  [SOD-923_L0.8-W0.6-LS1.0-BI]  202.56 155.57 0 top
U28  ESD9B5.0ST5G  [SOD-923_L0.8-W0.6-LS1.0-BI]  188.47 155.7 0 top
U29  ESD9B5.0ST5G  [SOD-923_L0.8-W0.6-LS1.0-BI]  180.09 155.7 0 top
U30  ESD9B5.0ST5G  [SOD-923_L0.8-W0.6-LS1.0-BI]  167 155.83 0 top
U31  ESD9B5.0ST5G  [SOD-923_L0.8-W0.6-LS1.0-BI]  159 155.83 0 top
U32  ESD9B5.0ST5G  [SOD-923_L0.8-W0.6-LS1.0-BI]  149.86 155.7 0 top
U33  ESD9B5.0ST5G  [SOD-923_L0.8-W0.6-LS1.0-BI]  141.61 155.83 0 top
U34  MCP6002DRG  [SOP-8_L4.9-W3.9-P1.27-LS6.0-BL]  111.12 141.86 270 top
U35  ESD9B5.0ST5G  [SOD-923_L0.8-W0.6-LS1.0-BI]  122.81 155.57 0 top
U36  ESD9B5.0ST5G  [SOD-923_L0.8-W0.6-LS1.0-BI]  114.68 155.57 0 top
U37  ESD9B5.0ST5G  [SOD-923_L0.8-W0.6-LS1.0-BI]  106.93 155.57 0 top
U38  ESD9B5.0ST5G  [SOD-923_L0.8-W0.6-LS1.0-BI]  98.93 155.57 0 top
U39  MCP6002DRG  [SOP-8_L4.9-W3.9-P1.27-LS6.0-BL]  154.05 141.73 270 top
USB_DFP1  USB_C_Receptacle_USB2.0  [USB-C-Power-tester:TYPE-C-31-M-14]  2.92 144.27 270 top
USB_UFP1  USB_C_Receptacle_USB2.0  [USB-C-Power-tester:TYPE-C-31-M-14]  17.65 163.7 180 top
Y1  Crystal_GND23  [Crystal:Crystal_SMD_Abracon_ABM3B-4Pin_5.0x3.2mm]  27.05 106.05 0 top
Y2  Crystal  [Crystal:Crystal_SMD_2012-2Pin_2.0x1.2mm]  -13.84 111 0 top

## Footprints (pads in the part's own frame, mm; a bottom-side part is the same pattern mirrored in y, then rotated)
AUDIO-SMD_HC-PJ-320A
  oval 2x1 hole 1.5x0.5: 1(4.15,-2.25) 2(-4.15,2.25) 3(-1.05,2.25) 4(3.05,2.25)
C0603
  rect 0.8x0.9 smd: 1(-0.7,0) 2(0.7,0)
C1206
  rect 1.485x1.728 smd: 1(-1.593,0) 2(1.593,0)
CAP-SMD_BD6.3-L6.6-W6.6-FD
  rect 3.5x1.2 smd: 1(-2.67,0) 2(2.67,0)
CAP-TH_BD8.0-P3.50-D0.6-FD
  round 1.6 hole 1: 1(-1.75,0) 2(1.75,0)
CAP-TH_L5.0-W2.5-P5.00-D1.0
  round 1.6 hole 1: 1(-2.5,0) 2(2.5,0)
Capacitor_SMD:C_0603_1608Metric
  rrect 0.875x0.95 smd: 1(-0.787,0) 2(0.787,0)
Capacitor_SMD:C_0805_2012Metric
  rrect 0.975x1.4 smd: 1(-0.938,0) 2(0.938,0)
CONN-TH_DIN-504B-M10
  round 2.2 hole 1.5: 1(-7.5,3.65) 2(-5,6.15) 3(0,3.65) 4(5,6.15) 5(7.5,3.65) 6(-5,-6.15) 7(5,-6.15)
Connector_PinHeader_1.00mm:PinHeader_1x01_P1.00mm_Vertical
  rect 0.85x0.85 hole 0.5: 1(0,0)
Crystal:Crystal_SMD_2012-2Pin_2.0x1.2mm
  rect 0.6x1.1 smd: 1(-0.7,0) 2(0.7,0)
Crystal:Crystal_SMD_Abracon_ABM3B-4Pin_5.0x3.2mm
  rect 1.8x1.2 smd: 1(-1.7,-1.1) 2(1.7,-1.1) 3(1.7,1.1) 4(-1.7,1.1)
DC-IN-TH_DC005
  oval 2x4.6 hole 1.2x3.7: 1(3.1,2.35) 2(-3.1,2.35)
  oval 4.6x2 hole 3.7x1.2: 3(0.1,-2.35)
DIP-8_L9.8-W6.6-P2.54-LS7.6-BL
  rect 1.5x1.5 hole 0.9: 1(-3.81,-3.81)
  round 1.5 hole 0.9: 2(-1.27,-3.81) 3(1.27,-3.81) 4(3.81,-3.81) 5(3.81,3.81) 6(1.27,3.81) 7(-1.27,3.81) 8(-3.81,3.81)
DO-15_BD3.1-L6.7-P10.70-D0.8-RD
  round 1.7 hole 1.06: 1(-5.35,0) 2(5.35,0)
DO-35_BD1.9-L3.9-P7.90-D0.5-FD
  round 1.524 hole 0.914: 1(-3.95,0) 2(3.95,0)
F1206
  rect 1.19x1.728 smd: 1(-1.445,0) 2(1.445,0)
F1812
  rect 1.407x3.499 smd: 1(-1.853,0) 2(1.853,0)
LED0603-RD_BLUE
  rect 0.8x0.8 smd: 1(-0.749,-0.004) 2(0.749,0.004)
LED-SMD_4P-L5.0-W5.0-BL_XL-5050RGBC
  rect 1x1.5 smd: 1(-1.5,-2.5) 2(1.5,-2.5) 3(1.5,2.5) 4(-1.5,2.5)
LED_SMD:LED_0402_1005Metric
  rrect 0.59x0.64 smd: 1(-0.485,0) 2(0.485,0)
MIMXRT1062DVJ6B:BGA196C80P14X14_1200X1200X152
  round 0.394 smd: A1(-5.2,5.2) A2(-4.4,5.2) A3(-3.6,5.2) A4(-2.8,5.2) A5(-2,5.2) A6(-1.2,5.2) A7(-0.4,5.2) A8(0.4,5.2) A9(1.2,5.2) A10(2,5.2) A11(2.8,5.2) A12(3.6,5.2) A13(4.4,5.2) A14(5.2,5.2) B1(-5.2,4.4) B2(-4.4,4.4) B3(-3.6,4.4) B4(-2.8,4.4) B5(-2,4.4) B6(-1.2,4.4) B7(-0.4,4.4) B8(0.4,4.4) B9(1.2,4.4) B10(2,4.4) B11(2.8,4.4) B12(3.6,4.4) B13(4.4,4.4) B14(5.2,4.4) C1(-5.2,3.6) C2(-4.4,3.6) C3(-3.6,3.6) C4(-2.8,3.6) C5(-2,3.6) C6(-1.2,3.6) C7(-0.4,3.6) C8(0.4,3.6) C9(1.2,3.6) C10(2,3.6) C11(2.8,3.6) C12(3.6,3.6) C13(4.4,3.6) C14(5.2,3.6) D1(-5.2,2.8) D2(-4.4,2.8) D3(-3.6,2.8) D4(-2.8,2.8) D5(-2,2.8) D6(-1.2,2.8) D7(-0.4,2.8) D8(0.4,2.8) D9(1.2,2.8) D10(2,2.8) D11(2.8,2.8) D12(3.6,2.8) D13(4.4,2.8) D14(5.2,2.8) E1(-5.2,2) E2(-4.4,2) E3(-3.6,2) E4(-2.8,2) E5(-2,2) E6(-1.2,2) E7(-0.4,2) E8(0.4,2) E9(1.2,2) E10(2,2) E11(2.8,2) E12(3.6,2) E13(4.4,2) E14(5.2,2) F1(-5.2,1.2) F2(-4.4,1.2) F3(-3.6,1.2) F4(-2.8,1.2) F5(-2,1.2) F6(-1.2,1.2) F7(-0.4,1.2) F8(0.4,1.2) F9(1.2,1.2) F10(2,1.2) F11(2.8,1.2) F12(3.6,1.2) F13(4.4,1.2) F14(5.2,1.2) G1(-5.2,0.4) G2(-4.4,0.4) G3(-3.6,0.4) G4(-2.8,0.4) G5(-2,0.4) G6(-1.2,0.4) G7(-0.4,0.4) G8(0.4,0.4) G9(1.2,0.4) G10(2,0.4) G11(2.8,0.4) G12(3.6,0.4) G13(4.4,0.4) G14(5.2,0.4) H1(-5.2,-0.4) H2(-4.4,-0.4) H3(-3.6,-0.4) H4(-2.8,-0.4) H5(-2,-0.4) H6(-1.2,-0.4) H7(-0.4,-0.4) H8(0.4,-0.4) H9(1.2,-0.4) H10(2,-0.4) H11(2.8,-0.4) H12(3.6,-0.4) H13(4.4,-0.4) H14(5.2,-0.4) J1(-5.2,-1.2) J2(-4.4,-1.2) J3(-3.6,-1.2) J4(-2.8,-1.2) J5(-2,-1.2) J6(-1.2,-1.2) J7(-0.4,-1.2) J8(0.4,-1.2) J9(1.2,-1.2) J10(2,-1.2) J11(2.8,-1.2) J12(3.6,-1.2) J13(4.4,-1.2) J14(5.2,-1.2) K1(-5.2,-2) K2(-4.4,-2) K3(-3.6,-2) K4(-2.8,-2) K5(-2,-2) K6(-1.2,-2) K7(-0.4,-2) K8(0.4,-2) K9(1.2,-2) K10(2,-2) K11(2.8,-2) K12(3.6,-2) K13(4.4,-2) K14(5.2,-2) L1(-5.2,-2.8) L2(-4.4,-2.8) L3(-3.6,-2.8) L4(-2.8,-2.8) L5(-2,-2.8) L6(-1.2,-2.8) L7(-0.4,-2.8) L8(0.4,-2.8) L9(1.2,-2.8) L10(2,-2.8) L11(2.8,-2.8) L12(3.6,-2.8) L13(4.4,-2.8) L14(5.2,-2.8) M1(-5.2,-3.6) M2(-4.4,-3.6) M3(-3.6,-3.6) M4(-2.8,-3.6) M5(-2,-3.6) M6(-1.2,-3.6) M7(-0.4,-3.6) M8(0.4,-3.6) M9(1.2,-3.6) M10(2,-3.6) M11(2.8,-3.6) M12(3.6,-3.6) M13(4.4,-3.6) M14(5.2,-3.6) N1(-5.2,-4.4) N2(-4.4,-4.4) N3(-3.6,-4.4) N4(-2.8,-4.4) N5(-2,-4.4) N6(-1.2,-4.4) N7(-0.4,-4.4) N8(0.4,-4.4) N9(1.2,-4.4) N10(2,-4.4) N11(2.8,-4.4) N12(3.6,-4.4) N13(4.4,-4.4) N14(5.2,-4.4) P1(-5.2,-5.2) P2(-4.4,-5.2) P3(-3.6,-5.2) P4(-2.8,-5.2) P5(-2,-5.2) P6(-1.2,-5.2) P7(-0.4,-5.2) P8(0.4,-5.2) P9(1.2,-5.2) P10(2,-5.2) P11(2.8,-5.2) P12(3.6,-5.2) P13(4.4,-5.2) P14(5.2,-5.2)
MIMXRT1062DVJ6B:XSON8_4x4mm
  rrect 0.8x0.4 smd: 1(-2.2,1) 2(-2.2,0.2) 3(-2.2,-0.6) 4(-2.2,-1.4) 5(1.8,-1.4) 6(1.8,-0.6) 7(1.8,0.2) 8(1.8,1)
OLED-TH_4P-L72.0-W43.0-P2.54
  rect 1.6x1.6 hole 1: 1(0,-3.81)
  round 1.6 hole 1: 2(0,-1.27) 3(0,1.27) 4(0,3.81)
Package_DFN_QFN:DFN-6-1EP_3x3mm_P0.95mm_EP1.7x2.6mm
  rect 0.66x0.73 smd: (-0.425,0.866) (-0.425,0) (-0.425,-0.866) (0.425,0.866) (0.425,0) (0.425,-0.866)
  rect 0.63x0.45 smd: 1(-1.34,0.95) 2(-1.34,0) 3(-1.34,-0.95) 4(1.34,-0.95) 5(1.34,0) 6(1.34,0.95)
  rect 1.7x2.6 smd: 7(0,0)
Package_DFN_QFN:QFN-16-1EP_3x3mm_P0.5mm_EP1.8x1.8mm
  rect 0.73x0.73 smd: (-0.45,0.45) (-0.45,-0.45) (0.45,0.45) (0.45,-0.45)
  oval 0.75x0.3 smd: 1(-1.475,0.75) 2(-1.475,0.25) 3(-1.475,-0.25) 4(-1.475,-0.75) 9(1.475,-0.75) 10(1.475,-0.25) 11(1.475,0.25) 12(1.475,0.75)
  oval 0.3x0.75 smd: 5(-0.75,-1.475) 6(-0.25,-1.475) 7(0.25,-1.475) 8(0.75,-1.475) 13(0.75,1.475) 14(0.25,1.475) 15(-0.25,1.475) 16(-0.75,1.475)
  rect 1.8x1.8 smd: 17(0,0)
Package_SO:SO-8_3.9x4.9mm_P1.27mm
  rrect 1.75x0.6 smd: 1(-2.575,1.905) 2(-2.575,0.635) 3(-2.575,-0.635) 4(-2.575,-1.905) 5(2.575,-1.905) 6(2.575,-0.635) 7(2.575,0.635) 8(2.575,1.905)
Package_TO_SOT_SMD:SOT-23
  rect 0.9x0.8 smd: 1(-1,0.95) 2(-1,-0.95) 3(1,0)
Package_TO_SOT_SMD:SOT-143
  rect 1.4x1.2 smd: 1(-1.1,0.77)
  rect 1.4x1 smd: 2(-1.1,-0.95) 3(1.1,-0.95) 4(1.1,0.95)
Pad_e146
  rect 0.61x0.61 smd: TP2(0,0)
Pad_e213
  rect 0.61x0.61 smd: TP3(0,0)
Pad_e215
  rect 0.61x0.61 smd: TP4(0,0)
Pad_e222
  rect 0.61x0.61 smd: TP5(0,0)
Pad_e223
  rect 0.61x0.61 smd: TP6(0,0)
Pad_e229
  rect 0.61x0.61 smd: TP7(0,0)
Pad_e234
  rect 0.61x0.61 smd: TP8(0,0)
Pad_e236
  rect 0.61x0.61 smd: TP9(0,0)
Pad_e370
  rect 0.61x0.61 smd: TP12(0,0)
Pad_e371
  rect 0.61x0.61 smd: TP12(0,0)
Pad_e372
  rect 0.61x0.61 smd: TP12(0,0)
Pad_e373
  rect 0.61x0.61 smd: TP12(0,0)
Pad_e724
  rect 0.61x0.61 smd: TP2(0,0)
Pad_e726
  rect 0.61x0.61 smd: TP2(0,0)
Pad_e730
  rect 0.61x0.61 smd: TP2(0,0)
Pad_e6013
  rect 0.61x0.61 smd: TP10(0,0)
Pad_e6015
  rect 0.61x0.61 smd: TP11(0,0)
Pad_e6017
  rect 0.61x0.61 smd: TP12(0,0)
Pad_e6019
  rect 0.61x0.61 smd: TP13(0,0)
Pad_e6020
  rect 0.61x0.61 smd: TP14(0,0)
Pad_e6021
  rect 0.61x0.61 smd: TP15(0,0)
Pad_e6022
  rect 0.61x0.61 smd: TP16(0,0)
Pad_e6023
  rect 0.61x0.61 smd: TP17(0,0)
Pad_e6029
  rect 0.61x0.61 smd: TP18(0,0)
Pad_e6035
  rect 0.61x0.61 smd: TP19(0,0)
Pad_e6036
  rect 0.61x0.61 smd: TP20(0,0)
Pad_e954561
  rect 0.61x0.61 smd: TP1(0,0)
Pad_e954570
  rect 0.61x0.61 smd: TP2(0,0)
Pad_e954575
  rect 0.61x0.61 smd: TP3(0,0)
Pad_e954935
  rect 0.61x0.61 smd: TP4(0,0)
Pad_e954937
  rect 0.61x0.61 smd: TP5(0,0)
Pad_e955723
  rect 0.61x0.61 smd: TP6(0,0)
PDIP-14_L19.3-W6.4-P2.54-LS7.6-BL
  rect 1.5x2 hole 1: 1(-7.62,-3.81)
  oval 1.5x2 hole 1: 2(-5.08,-3.81) 3(-2.54,-3.81) 4(0,-3.81) 5(2.54,-3.81) 6(5.08,-3.81) 7(7.62,-3.81) 8(7.62,3.81) 9(5.08,3.81) 10(2.54,3.81) 11(0,3.81) 12(-2.54,3.81) 13(-5.08,3.81) 14(-7.62,3.81)
R0603
  rect 0.806x0.864 smd: 1(-0.753,0) 2(0.753,0)
RES-ADJ-TH_RK09K1130A5R
  round 1.5 hole 1: 1(-2.5,-3.5) 2(0,-3.5) 3(2.5,-3.5)
  oval 3x3.3 hole 2x2.3: 4(4.4,3.5) 5(-4.4,3.5)
RES-TH_BD1.7-L3.5-P7.50-D0.5
  round 1.2 hole 0.6: 1(-3.75,0) 2(3.75,0)
Resistor_SMD:R_0805_2012Metric
  rrect 0.975x1.4 smd: 1(-0.938,0) 2(0.938,0)
SOD-923_L0.8-W0.6-LS1.0-BI
  rect 0.5x0.4 smd: 1(-0.457,0) 2(0.457,0)
SOIC-24_L15.4-W7.5-P1.27-LS10.3-BL
  oval 0.574x2.388 smd: 1(-6.985,-4.744) 2(-5.715,-4.744) 3(-4.445,-4.744) 4(-3.175,-4.744) 5(-1.905,-4.744) 6(-0.635,-4.744) 7(0.635,-4.744) 8(1.905,-4.744) 9(3.175,-4.744) 10(4.445,-4.744) 11(5.715,-4.744) 12(6.985,-4.744) 13(6.985,4.744) 14(5.715,4.744) 15(4.445,4.744) 16(3.175,4.744) 17(1.905,4.744) 18(0.635,4.744) 19(-0.635,4.744) 20(-1.905,4.744) 21(-3.175,4.744) 22(-4.445,4.744) 23(-5.715,4.744) 24(-6.985,4.744)
SOP-8_L4.9-W3.9-P1.27-LS6.0-BL
  oval 0.63x1.865 smd: 1(-1.905,-2.683) 2(-0.635,-2.683) 3(0.635,-2.683) 4(1.905,-2.683) 5(1.905,2.683) 6(0.635,2.683) 7(-0.635,2.683) 8(-1.905,2.683)
SW-SMD_4P-L12.0-W12.0-P5.00-LS15.5
  rect 3x2 smd: 1(-7.5,2.5) 2(7.5,2.5) 3(-7.5,-2.5) 4(7.5,-2.5)
SW-TH_TK-6580A-1
  round 1.524 hole 0.914: 1(3.35,-1.6) 2(3.35,0.4) 3(-3.35,-1.6) 4(-3.35,0.4) 5(1,1.6) 6(-1,1.6)
TestPoint:TestPoint_Pad_D1.0mm
  round 1 smd: 1(0,0)
ToyTronics:KMR241GLFS
  rect 1.194x0.508 smd: 1(-2.006,0.805) 1(2.006,0.805) 2(-2.006,-0.805) 2(2.006,-0.805)
USB-C-Power-tester:APA102-2020
  rect 0.7x0.45 smd: 1(-0.8,0.85) 3(-0.8,-0.85) 4(0.8,-0.85) 6(0.8,0.85)
  rect 0.25x0.65 smd: 1(0,1) 6(0,-1)
  rect 0.8x0.3 smd: 2(-0.8,0) 5(0.8,0)
USB-C-Power-tester:TYPE-C-31-M-14
  round 0.65 hole 0.65: (-3.75,3.725) (3.75,3.725)
  rect 0.3x1.45 smd: A1(-3.4,5.1) A4(-2.6,5.1) A9(2.6,5.1) A12(3.4,5.1) B1(3.1,5.1) B4(2.3,5.1) B9(-2.3,5.1) B12(-3.1,5.1)
  rect 0.25x1.45 smd: A5(-1.25,5.1) A6(-0.25,5.1) A7(0.25,5.1) A8(1.25,5.1) B5(1.75,5.1) B6(0.75,5.1) B7(-0.75,5.1) B8(-1.75,5.1)
  rrect 1x2.2 hole 0.5x1.65: S1(-5.58,3.64) S1(-5.58,-1.03) S1(5.58,3.64) S1(5.58,-1.04)

## Nets
As in the schematic, except:
3VDC: C50.2 C62.2 C63.2 C73.1 C74.1 C126.2 C133.2 COL_MUX2.24 D49.1 D114.1 D116.1 NOREF#4.TP12 NOREF#22.TP13 NOREF#30.TP7 R61.1 R63.2 R65.1 R72.1 R73.1 R74.1 R75.1 R76.1 R77.1 R88.1 R92.1 R120.1 R123.1 R132.2 R138.1 R141.1 R150.2 ROW_MUX2.24 RV4.1 RV5.1 RV6.1 Screen.2 SW50.2 SW51.2 SW52.2 SW53.2 SW54.2 SW55.2 U23.2 U23.8 U34.2 U34.8 U39.2 U39.8
GND: C1.1 C1.2 C2.1 C2.2 C3.1 C3.2 C4.2 C5.1 C6.1 C7.1 C8.2 C9.2 C10.2 C11.2 C12.2 C13.2 C14.2 C15.2 C16.2 C17.2 C18.2 C19.2 C20.2 C21.2 C22.2 C23.2 C24.2 C25.2 C26.2 C48.1 C49.2 C50.1 C51.1 C52.1 C61.2 C62.1 C63.1 C64.1 C65.2 C66.2 C67.2 C68.2 C69.2 C70.2 C73.2 C74.2 C75.2 C76.2 C77.1 C78.2 C79.2 C80.2 C81.2 C82.2 C83.2 C84.2 C85.2 C86.2 C87.2 C88.2 C89.2 C90.2 C91.2 C92.2 C93.2 C94.2 C95.2 C96.2 C97.2 C98.2 C99.2 C100.2 C101.2 C102.2 C103.2 C104.2 C105.2 C106.2 C107.2 C108.2 C109.2 C110.2 C111.2 C112.2 C113.2 C114.2 C115.2 C116.2 C117.2 C118.2 C119.2 C120.2 C121.2 C124.1 C125.2 C126.1 C127.1 C128.1 C131.1 C132.2 C133.1 C134.1 C135.1 C138.2 C139.2 C140.2 C141.2 C142.2 COL_MUX2.3 COL_MUX2.12 COL_MUX2.15 D1.1 D1.2 D2.2 D3.1 D44.2 D78.2 D79.4 D109.3 D110.2 D111.2 D111.3 D113.4 Di3.1 F2.1 IC1.A1 IC1.A14 IC1.B5 IC1.B10 IC1.E2 IC1.E13 IC1.G7 IC1.G8 IC1.G14 IC1.H7 IC1.H8 IC1.J7 IC1.J8 IC1.K2 IC1.K9 IC1.K13 IC1.L9 IC1.N1 IC1.N2 IC1.N5 IC1.N6 IC1.N8 IC1.P1 IC1.P6 IC1.P14 J1.2 J1.3 J8.1 J8.4 J9.1 J9.4 J12.2 J13.2 J14.1 J14.3 J15.1 J15.3 J16.1 J16.4 J17.1 J17.4 J18.1 J18.4 J19.1 J19.4 LEDPWR3.1 NCP692.1 NCP692.2 NCP692.6 NCP692.7 NOREF#17.TP18 PROG1.2 Q1.3 R1.1 R2.1 R3.1 R5.1 R6.1 R7.1 R9.1 R11.1 R15.1 R16.1 R60.2 R64.2 R122.2 R129.2 R140.2 R147.2 ROW_MUX2.12 ROW_MUX2.15 ROW_MUX2.16 ROW_MUX2.17 ROW_MUX2.18 ROW_MUX2.19 ROW_MUX2.20 ROW_MUX2.21 ROW_MUX2.22 ROW_MUX2.23 RV4.3 RV4.4 RV4.5 RV5.3 RV5.4 RV5.5 RV6.3 RV6.4 RV6.5 Screen.1 SW49.1 SW49.3 TP1.1 U1.1 U1.6 U2.3 U2.5 U2.7 U3.4 U4.2 U4.17 U8.1 U8.4 U8.7 U8.8 U8.9 U8.10 U8.11 U8.12 U8.13 U23.4 U25.5 U25.8 U26.2 U27.1 U28.2 U29.2 U30.2 U31.1 U32.2 U33.2 U34.4 U35.2 U36.1 U37.2 U38.2 U39.4 USB_DFP1.A1 USB_DFP1.A12 USB_DFP1.B1 USB_DFP1.B12 USB_UFP1.A1 USB_UFP1.A4 USB_UFP1.A9 USB_UFP1.A12 USB_UFP1.B1 USB_UFP1.B4 USB_UFP1.B9 USB_UFP1.B12 Y1.2 Y1.4
VIN_FUSED: C5.2 C6.2 D44.1 F1.2 NOREF#21.TP3 SW49.4 SW49.6 U6.1
VIN_RAW: F1.1 J1.1 NOREF#6.TP2
E1: C49.1 NOREF#16.TP17 R116.2 R156.1
E2: C52.2 NOREF#13.TP16 R117.2 R157.1
E3: C125.1 NOREF#10.TP15 R133.2 R158.1
E4: C128.2 NOREF#14.TP14 R135.2 R159.1
E6: C135.2 NOREF#5.TP4 NOREF#7.TP2 NOREF#8.TP1 NOREF#9.TP5 NOREF#12.TP2 NOREF#23.TP3 NOREF#25.TP2 NOREF#28.TP2 R153.2 R161.1
LED: IC1.D9 NOREF#2.TP12 U8.2
MIDI_RX: IC1.G11 NOREF#27.TP10 R88.2 U25.6
MIDI_TX: IC1.M11 NOREF#20.TP11 U8.5
MRR: IC1.H13 NOREF#26.TP9 ROW_MUX2.1
PMIC_ON_REQ_PWR_SEQ: IC1.K7 NCP692.3 R4.1 TP3.1
SCL: IC1.J11 NOREF#29.TP19 R91.1 R92.2 Screen.3
SDA: IC1.K11 NOREF#11.TP20 R91.2 Screen.4
$4N5610: C114.1 D105.3 D106.1 NOREF#18.TP12
$4N5612: C116.1 D107.3 D108.1 NOREF#15.TP12
$4N5621: C120.1 D111.1 D112.3 NOREF#19.TP12
$5N1584: C122.2 NOREF#3.TP6 NOREF#24.TP6 NOREF#31.TP5 R115.1 U23.3
$6N5824: IC1.A7 R16.2 U2.1

Pads without a net: D104 1; IC1 A3 A4 A5 A6 A8 A9 A12 A13 B1 B2 B4 B6 B7 B8 B9 B12 B13 B14 C1 C2 C4 C6 C7 C8 C9 C12 C13 C14 D4 D6 D12 E3 E5 E10 E11 E12 F4 G1 G2 G3 G4 H1 H10 H14 K6 L5 L7 L10 M3 M4 M5 M14 N3 N10 N12 N13 P2 P13; J12 1 3 6 7; J13 1 3 6 7; SW1 3 4; SW2 3 4; SW3 3 4; SW4 3 4; SW5 3 4; SW6 3 4; SW7 3 4; SW8 3 4; SW9 3 4; SW10 3 4; SW11 3 4; SW12 3 4; SW13 3 4; SW14 3 4; SW15 3 4; SW16 3 4; SW17 3 4; SW18 3 4; SW19 3 4; SW20 3 4; SW21 3 4; SW22 3 4; SW23 3 4; SW24 3 4; SW25 3 4; SW26 3 4; SW27 3 4; SW28 3 4; SW29 3 4; SW30 3 4; SW31 3 4; SW32 3 4; SW33 3 4; SW34 3 4; SW35 3 4; SW36 3 4; SW37 3 4; SW38 3 4; SW39 3 4; SW40 3 4; SW41 3 4; SW42 3 4; SW50 3 4; SW51 3 4; SW52 3 4; SW53 3 4; SW54 3 4; SW55 3 4; U1 2 3; U4 14 16; U25 1 4; USB_DFP1 A8 B8; USB_UFP1 A8 B8

## Copper pours and planes (outline as drawn; the poured copper is in the pictures)
GND on Bottom Layer: 159.83,161.93 163.9,161.93 163.9,156.68 159.83,156.68
GND on Bottom Layer: 39.37,159.51 50.16,159.51 50.16,156.46 39.37,156.46
GND on Bottom Layer: 95.89,166.24 102.23,166.24 102.23,154.31 95.89,154.31
GND on Bottom Layer: 121.67,166.24 144.4,166.24 144.4,153.42 121.67,153.42
GND on Bottom Layer: 144.14,154.99 165.86,154.99 165.86,153.38 144.14,153.38
GND on Bottom Layer: 49.28,162.05 91.44,162.05 91.44,155.57 49.28,155.57
GND on Bottom Layer: 116.2,166.22 117.48,166.22 117.48,153.34 116.2,153.34
GND on Bottom Layer: 24.87,166.12 40.77,166.12 40.77,158.37 24.87,158.37
GND on Bottom Layer: 213.5,166.24 225.3,166.24 225.3,132.72 213.5,132.72
GND on Bottom Layer: 143.88,161.95 149.11,161.95 149.11,156.96 143.88,156.96
GND on Bottom Layer: 8.89,166.12 25.07,166.12 25.07,153.92 8.89,153.92
GND on Bottom Layer: 198.59,166.3 205.99,166.3 205.99,156.48 198.59,156.48
GND on Bottom Layer: 86.86,159.19 97.82,159.19 97.82,157.01 86.86,157.01
GND on Bottom Layer: 168.13,166.2 183.53,166.2 183.53,156.63 168.13,156.63
GND on Bottom Layer: 115.88,161.93 119.96,161.93 119.96,156.68 115.88,156.68
GND on Bottom Layer: 163.19,156.84 185.67,156.84 185.67,152.91 163.19,152.91
GND on Bottom Layer: 98.3,136.81 99.57,136.81 99.57,109.58 98.3,109.58
GND on Bottom Layer: 185.42,153.8 210.44,153.8 210.44,152.63 185.42,152.63
GND on Bottom Layer: 99.82,154.56 127.05,154.56 127.05,153.29 99.82,153.29
GND on Bottom Layer: 204.6,156.84 225.17,156.84 225.17,152.78 204.6,152.78
GND on Bottom Layer: 93.09,150.5 214.51,150.5 214.51,132.72 93.09,132.72
GND on Bottom Layer: 101.85,161.93 104.54,161.93 104.54,156.68 101.85,156.68
GND on Bottom Layer: 8.25,132.08 225.04,132.08 225.04,1.27 8.25,1.27

## Text on the board
Document Layer: MOARkNOBS-42
Top Silkscreen Layer: GND | VIN_FUSED | MCR | MRR | VLED | VREF | 3.3 | MOAR k NOBS - 42 | v2 | brain | PWR | f2 | f1 | MAIN | MIDI IN | MIDI OUT | 1x1 | 1x2 | 1x3 | 1x4 | 1x5 | 1x6 | LED | EF6 | 2x1 | 2x2 | 2x3 | 2x4 | 2x5 | 2x6 | EF5 | 3x1 | 3x2 | 3x3 | 3x4 | 3x5 | 3x6 | 4x1 | 4x2 | 4x4 | 4x3 | 4x5 | 4x6 | EF4 | EF3 | 5x1 | 5x2 | 5x4 | 5x3 | 5x6 | 5x5 | 6x2 | 6x1 | 6x4 | 6x3 | 6x5 | 6x6 | EF2 | 7x1 | 7x2 | 7x4 | 7x3 | 7x5 | 7x6 | EF1 | \\  |  / / CNTRL / /  |  \\ | FOLLOW / ME | EF/DISP-TEST | MIDI-TEST
